# EAGLE schematic encoder (EAGLE 6.0)
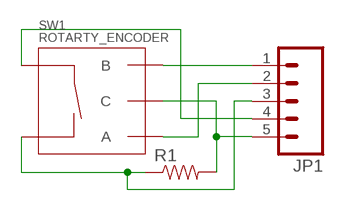
[diagram p0: schematic, sheet 1]

## Parts
JP1  M05PTH  [1X05]
R1  RESISTORPTH-1/4W  [AXIAL-0.4]
SW1  ROTARTY_ENCODER  [ROTARY_ENC_PLAIN]

## Nets
N$1: JP1.1 SW1.B
N$2: JP1.2 SW1.A
N$3: JP1.5 R1.P$2 SW1.C
N$4: JP1.3 R1.P$1 SW1.SW-
N$6: JP1.4 SW1.SW+

## Library data of the parts
JP1 = SparkFun-Connectors:M05: Header 5 Standard 5-pin 0.1" header. Use with straight break away headers (SKU : PRT-00116), right angle break away headers (PRT-00553), swiss pins (PRT-00743), machine pins (PRT-00117), and female headers (PRT-00115). Molex polarized connector foot print use with SKU : PRT-08230 with associated crimp pins and housings.
R1 = SparkFun-Passives:RESISTOR: Resistor Basic schematic elements and footprints for 0603, 1206, and PTH resistors.
SW1 = SparkFun-Electromechanical:ROTARTY_ENCODER: Simple no LED rotary encoder Example: COM-09117